# Altium schematic sheet PoE.SchDoc
size 420 x 297 mm; SPICEModelCacheUYAYKKGT: <root> / <DocumentId>UYAYKKGT</DocumentId> / <CacheFrame Number="0"> / <Model Name="1206_885012008079_10nf" Kind="CKT"> / <Text>******* / .subckt 1206_885012008079_10nF 1 2 / Rser 1 3 0.0235458917441 / Lser 2 4 4.56933086E-10 / C1 3 4 0.00000001 / Rpar 3 4 10000000000 / .ends 1206_885012008079_10nF</Text> / </Model> / <Model Name="0603_885012206114_10nf" Kind="CKT"> / <Text>******* / .subckt 0603_885012206114_10nF 1 2 / Rser 1 3 0.0614305159536 / Lser 2 4 4.58570264E-10 / C1 3 4 0.00000001 / Rpar 3 4 10000000000 / .ends 0603_885012206114_10nF</Text> / </Model> / <Model Name="0603_885012206095_100nf" Kind="CKT"> / <Text>******* / .subckt 0603_885012206095_100nF 1 2 / Rser 1 3 0.0157659152881 / Lser 2 4 3.10171966E-10 / C1 3 4 0.0000001 / Rpar 3 4 5000000000 / .ends 0603_885012206095_100nF</Text> / </Model> / <Model Name="0603_885012106006_10uf" Kind="CKT"> / <Text>******* / .subckt 0603_885012106006_10uF 1 2 / Rser 1 3 0.00407641026021 / Lser 2 4 4.16060333E-10 / C1 3 4 0.00001 / Rpar 3 4 5000000 / .ends 0603_885012106006_10uF</Text> / </Model> / <Model Name="1806_74279246_1000ohm" Kind="CKT"> / <Text>******* / .subckt 1806_74279246_1000ohm 1 2 / Rp 1 2 1045 / Cp 1 2 1.241p / Rs 1 N3 0.056 / L1 N3 2 3.003u / .ends 1806_74279246_1000ohm</Text> / </Model> / </CacheFrame> / </root>; SheetNumber: 7; SheetTotal: 11
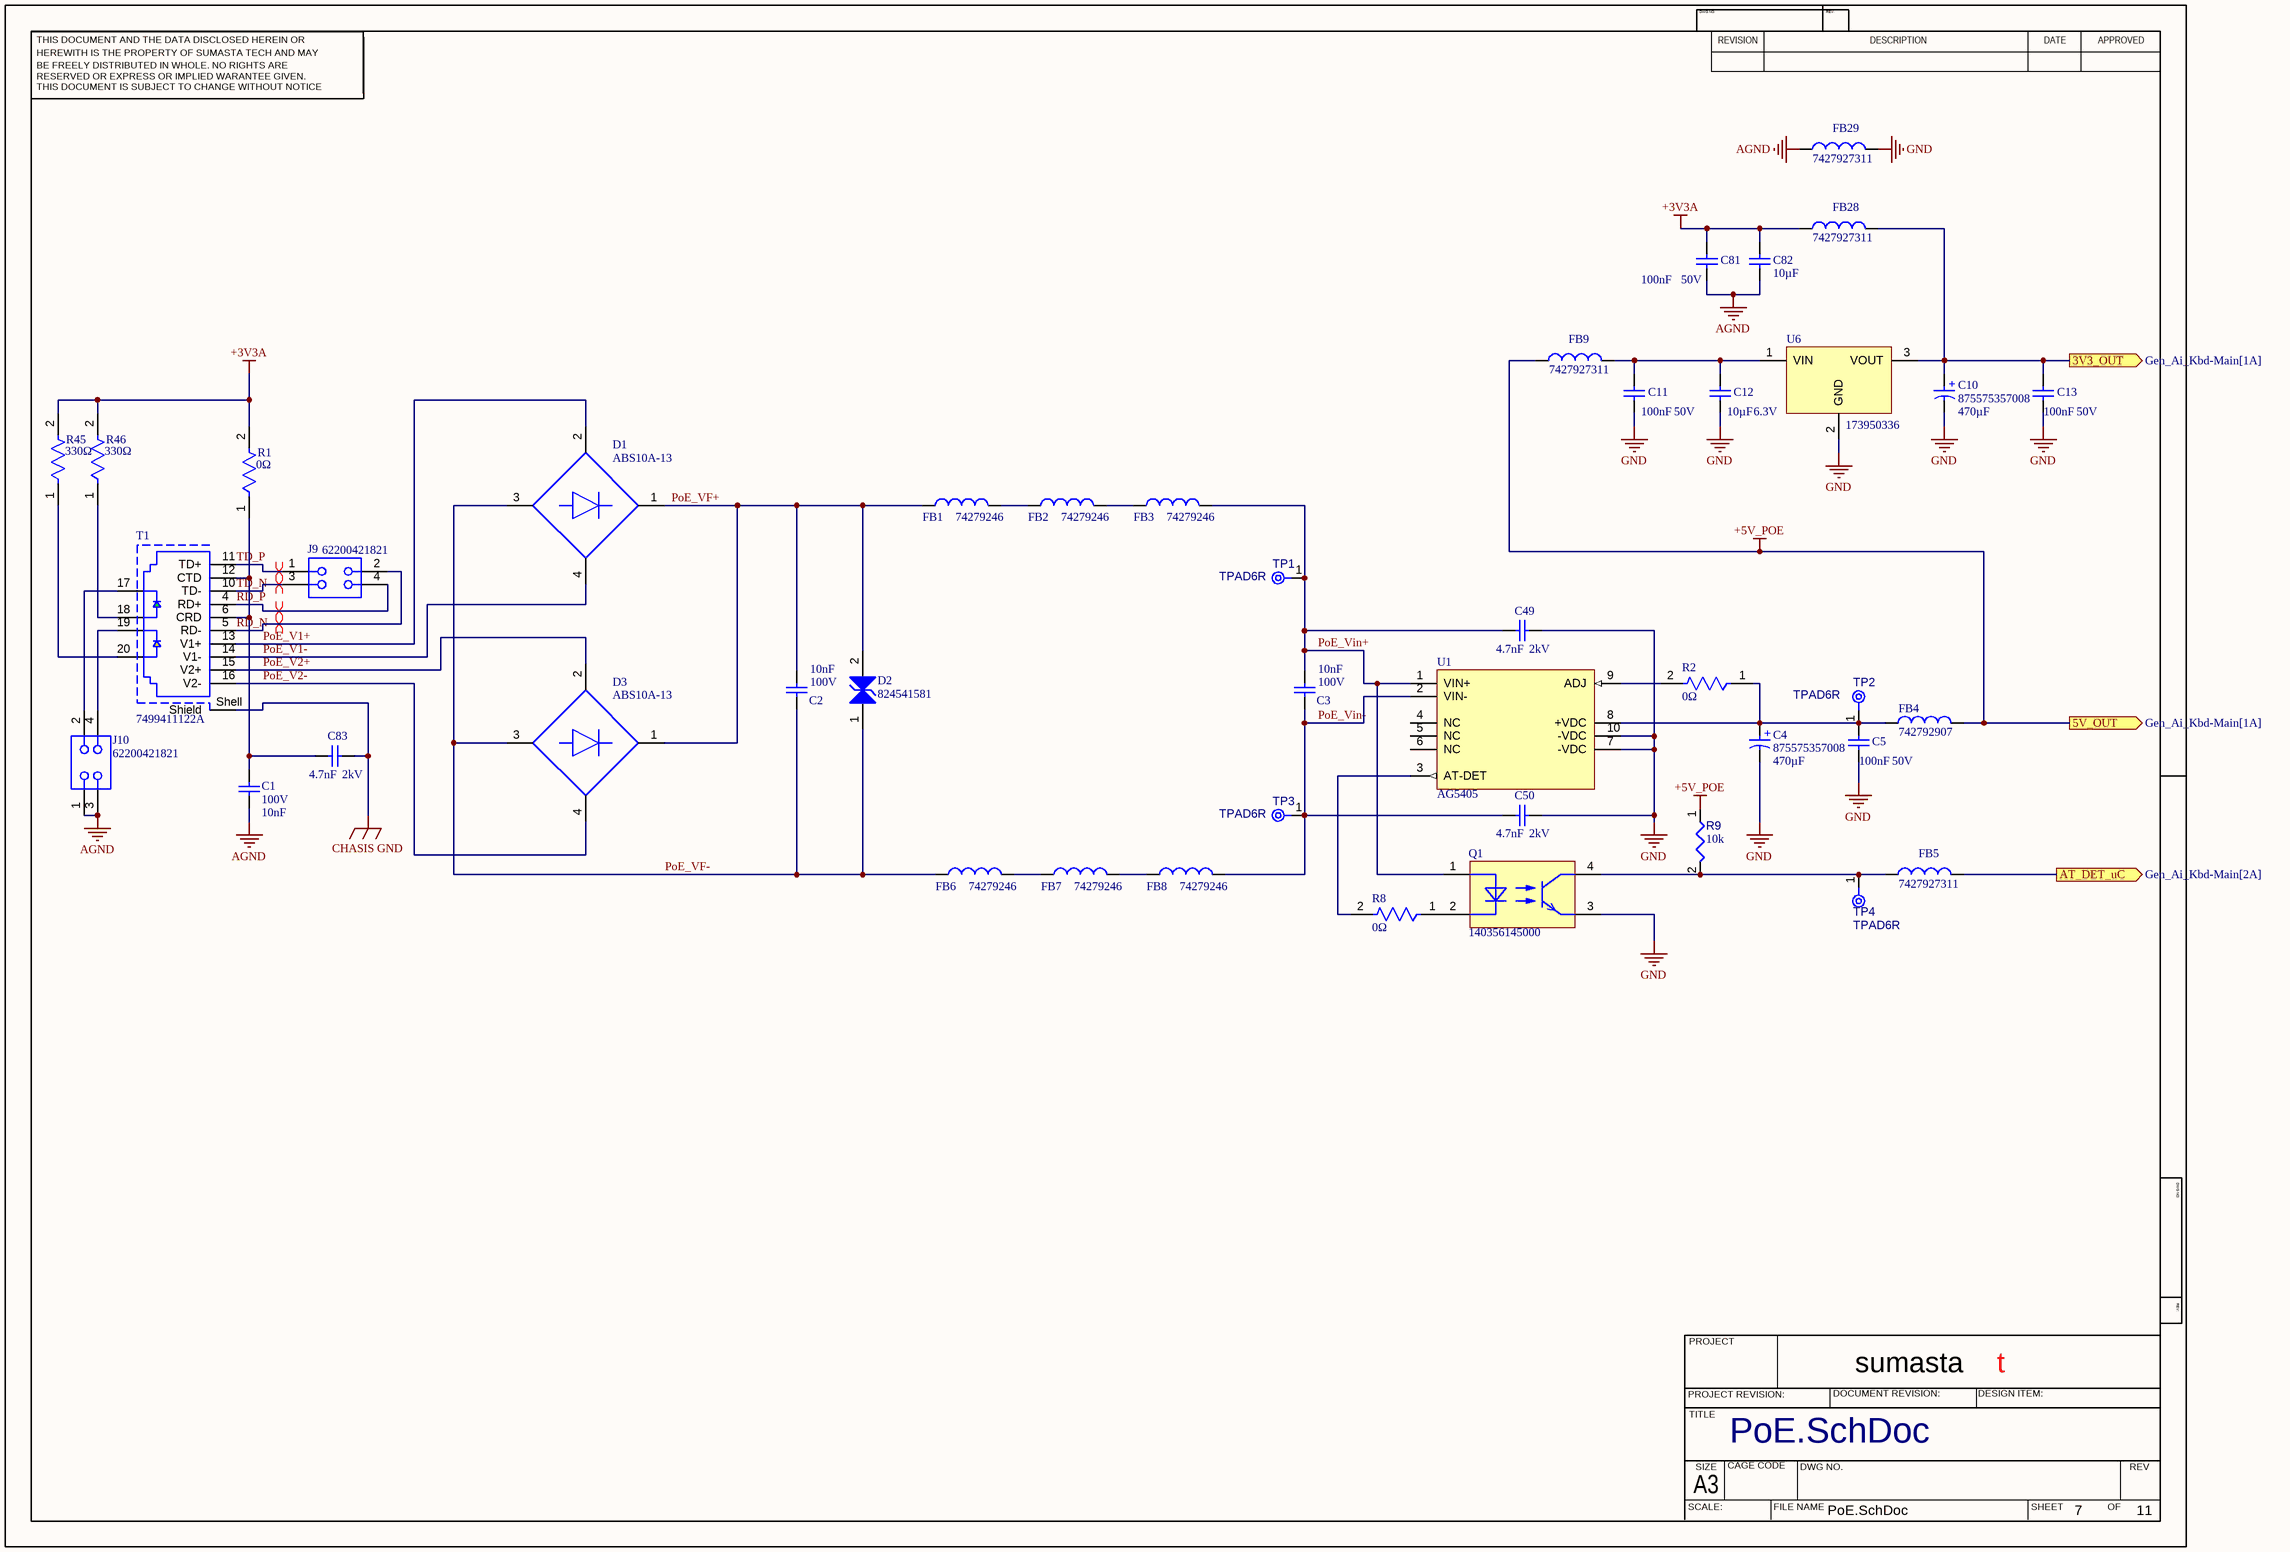
[diagram p0: PoE.SchDoc]

## Parts
C1  Rated Voltage (DC): 100V  Capacitance: 10nF  [WCAP-CSGP_0603_L1.6W0.8H0.8_Reflow]  (hidden comment: 885012206114)
C2  Rated Voltage (DC): 100V  Capacitance: 10nF  [WCAP-CSGP_1206_L3.2W1.6H1.25]  (hidden comment: 885012008079)
C3  Rated Voltage (DC): 100V  Capacitance: 10nF  [WCAP-CSGP_1206_L3.2W1.6H1.25]  (hidden comment: 885012008079)
C4  875575357008  Capacitance: 470µF  [WCAP-HSG5_D10H10.5]
C5  Capacitance: 100nF  Rated Voltage (DC): 50V  [WCAP-CSGP_0603_L1.6W0.8H0.8_Reflow]  (hidden comment: 885012206095)
C10  875575357008  Capacitance: 470µF  [WCAP-HSG5_D10H10.5]
C11  Capacitance: 100nF  Rated Voltage (DC): 50V  [WCAP-CSGP_0603_L1.6W0.8H0.8_Reflow]  (hidden comment: 885012206095)
C12  Rated Voltage (DC): 6.3V  Capacitance: 10µF  [WCAP-CSGP_0603_L1.6W0.8H0.8_Reflow]  (hidden comment: 885012106006)
C13  Capacitance: 100nF  Rated Voltage (DC): 50V  [WCAP-CSGP_0603_L1.6W0.8H0.8_Reflow]  (hidden comment: 885012206095)
C49  Voltage Rating (DC): 2kV  Capacitance: 4.7nF  [WCAP-CSMH_1812_L4.5W3.2H2]  (hidden comment: 885342211008)
C50  Voltage Rating (DC): 2kV  Capacitance: 4.7nF  [WCAP-CSMH_1812_L4.5W3.2H2]  (hidden comment: 885342211008)
C81  Capacitance: 100nF  Rated Voltage (DC): 50V  [WCAP-CSGP_0603_L1.6W0.8H0.8_Reflow]  (hidden comment: 885012206095)
C82  Capacitance: 10µF  [WCAP-CSGP_0603_L1.6W0.8H0.8_Reflow]  (hidden comment: 885012106006)
C83  Voltage Rating (DC): 2kV  Capacitance: 4.7nF  [WCAP-CSMH_1812_L4.5W3.2H2]  (hidden comment: 885342211008)
D1  ABS10A-13  [FP-SOPA-4-MFG]
D2  824541581  [WE-TVSP_DO-214AB_Bidirectional]
D3  ABS10A-13  [FP-SOPA-4-MFG]
FB1  74279246  [WE-CBF_1806_L4.5W1.6H1.6_HS/WB]
FB2  74279246  [WE-CBF_1806_L4.5W1.6H1.6_HS/WB]
FB3  74279246  [WE-CBF_1806_L4.5W1.6H1.6_HS/WB]
FB4  742792907  [WE-PF_1280]
FB5  7427927311  [WE-CBF_0402_L1W0.5H0.5_HC]
FB6  74279246  [WE-CBF_1806_L4.5W1.6H1.6_HS/WB]
FB7  74279246  [WE-CBF_1806_L4.5W1.6H1.6_HS/WB]
FB8  74279246  [WE-CBF_1806_L4.5W1.6H1.6_HS/WB]
FB9  7427927311  [WE-CBF_0402_L1W0.5H0.5_HC]
FB28  7427927311  [WE-CBF_0402_L1W0.5H0.5_HC]
FB29  7427927311  [WE-CBF_0402_L1W0.5H0.5_HC]
J9  62200421821  [62200421821]
J10  62200421821  [62200421821]
Q1  140356145000  [WL-OCPT_SOP4]
R1  value 0Ω  [FP-RC0603-MFG]  (hidden comment: RC0603FR-070RL)
R2  value 0Ω  [FP-RC0603-MFG]  (hidden comment: RC0603FR-070RL)
R8  value 0Ω  [FP-RC0603-MFG]  (hidden comment: RC0603FR-070RL)
R9  value 10k  [RESC1608X55X25ML10T15]  (hidden comment: Resistor 10k +/-1% 0603 100 mW)
R45  value 330Ω  [FP-RC0603-MFG]  (hidden comment: RC0603FR-070RL)
R46  value 330Ω  [FP-RC0603-MFG]  (hidden comment: RC0603FR-070RL)
T1  7499411122A  [7499411122A]
TP1  TPAD6R  [TP06R]  (no BOM)
TP2  TPAD6R  [TP06R]  (no BOM)
TP3  TPAD6R  [TP06R]  (no BOM)
TP4  TPAD6R  [TP06R]  (no BOM)
U1  AG5405  [AG540X]
U6  173950336  [WPME-FDSM_SIP-3_L11.6W7.55H10.16]

## Ports
3V3_OUT (out, see Gen_Ai_Kbd-Main[1A]), 5V_OUT (out, see Gen_Ai_Kbd-Main[1A]), AT_DET_uC (out, see Gen_Ai_Kbd-Main[2A])

## Nets
+3V3A: C81.2 C82.2 FB28.1 R1.2 R45.2 R46.2
+5V_POE: FB4.2 FB9.1 R9.1 ; port 5V_OUT
AGND: C1.2 C81.1 C82.1 FB29.1 J10.1 J10.3
CHASIS GND: C83.2 T1.Shell(Shield)
GND: C4.2(N) C5.1 C10.2(N) C11.1 C12.1 C13.1 C49.2 C50.2 FB29.2 Q1.3(Emitter) U1.7(-VDC) U1.10(-VDC) U6.2(GND)
3V3_OUT: C10.1(P) C13.2 FB28.2 U6.3(VOUT) ; port 3V3_OUT
AT_DET_uC: FB5.2 ; port AT_DET_uC
PoE_V1+: D1.2(1_~) T1.13(V1+)
PoE_V1-: D1.4(2_~) T1.14(V1-)
PoE_V2+: D3.2(1_~) T1.15(V2+)
PoE_V2-: D3.4(2_~) T1.16(V2-)
PoE_VF+: C2.2 D1.1(+) D2.2 D3.1(+) FB1.1
PoE_VF-: C2.1 D1.3(-) D2.1 D3.3(-) FB6.1
PoE_Vin+: C3.2 C49.1 FB3.2 Q1.1(Anode) TP1.1(TP) U1.1(VIN+)
PoE_Vin-: C3.1 C50.1 FB8.2 TP3.1(TP) U1.2(VIN-)
RD_N: J9.2 T1.5(RD-)
RD_P: J9.4 T1.4(RD+)
TD_N: J9.3 T1.10(TD-)
TD_P: J9.1 T1.11(TD+)
NetC1_1: C1.1 C83.1 R1.1 T1.6(CRD) T1.12(CTD)
NetC4_1: C4.1(P) C5.2 FB4.1 R2.1 TP2.1(TP) U1.8(+VDC)
NetC11_2: C11.2 C12.2 FB9.2 U6.1(VIN)
NetFB1_2: FB1.2 FB2.1
NetFB2_2: FB2.2 FB3.1
NetFB5_1: FB5.1 Q1.4(Collector) R9.2 TP4.1(TP)
NetFB6_2: FB6.2 FB7.1
NetFB7_2: FB7.2 FB8.1
NetJ10_2: J10.2 T1.17
NetJ10_4: J10.4 T1.19
NetQ1_2: Q1.2(Cathode) R8.1
NetR2_2: R2.2 U1.9(ADJ)
NetR8_2: R8.2 U1.3(AT-DET)
NetR45_1: R45.1 T1.20
NetR46_1: R46.1 T1.18

Not connected (* = marked no-connect by the designer): U1 4(NC) 5(NC) 6(NC)

## Layout directives
differential pair: RD_N, RD_P, TD_N, TD_P

## Notes on the sheet
- THIS DOCUMENT AND THE DATA DISCLOSED HEREIN OR
- HEREWITH IS THE PROPERTY OF SUMASTA TECH AND MAY
- DWG NO:
- REVISION
- REV:
- DESCRIPTION
- DATE
- APPROVED
- BE FREELY DISTRIBUTED IN WHOLE. NO RIGHTS ARE
- THIS DOCUMENT IS SUBJECT TO CHANGE WITHOUT NOTICE
- RESERVED OR EXPRESS OR IMPLIED WARANTEE GIVEN.
- PROJECT
- sumasta
- t
- PROJECT REVISION:
- TITLE
- DOCUMENT REVISION:
- DESIGN ITEM:
- SCALE:
- A3
- SIZE
- CAGE CODE
- FILE NAME
- DWG NO.
- SHEET
- OF
- REV
- (in symbol CMP-03913-134709151-1) +

## Library data of the parts
C1 = CMP-007-000667-1: WCAP-CSGP Multilayer Ceramic Chip Capacitor, General Purpose, size 0603, X7R, 10nF, 100VDC; Manufacturer: Wurth Elektronik; Technical Reference: X7R0603103K100DFCT10000; Insulation Resistance: 10GO; Dissipation Factor: 2.5%; Case/Size Code: 0603; Capacitance Tolerance: +/-10%; Width: 0.8mm; ComponentLink2URL: https://www.we-online.com/redexpert/spec/885012206114?ad; Packaging: Tape and Reel; Match Code: WCAP-CSGP; Source: WCAP-CSGP.SchLib; Mount: Surface Mount; Design Item ID: 885012206114; Category: Multilayer Ceramic Chip Capacitors; Manufacturer Part Number: 885012206114; Operating Temperature Max: 125°C; Operating Temperature Min: -55°C; Pin Count: 2; Height: 0.8mm; ComponentLink1URL: https://www.we-online.com/redexpert/article/885012206114?ad; ComponentLink2Description: Datasheet Link; Component Type: Standard; ComponentLink1Description: Website Link; Ceramic Type: X7R; Length: 1.6mm
C2 C3 = CMP-007-000324-1: WCAP-CSGP Multilayer Ceramic Chip Capacitor, General Purpose, size 1206, NP0, 10nF, 100VDC; Manufacturer: Wurth Elektronik; Technical Reference: NP01206103J100DFCT10000; Q Factor: 1000; Insulation Resistance: 10GO; Capacitance Tolerance: +/-5%; Case/Size Code: 1206; ComponentLink2URL: https://www.we-online.com/redexpert/spec/885012008079?ad; Packaging: Tape and Reel; Source: WCAP-CSGP.SchLib; Width: 1.6mm; Pin Count: 2; Match Code: WCAP-CSGP; Length: 3.2mm; ComponentLink1URL: https://www.we-online.com/redexpert/article/885012008079?ad; Ceramic Type: NP0; Mount: Surface Mount; ComponentLink2Description: Datasheet Link; Manufacturer Part Number: 885012008079; Operating Temperature Max: 125°C; Height: 1.25mm; ComponentLink1Description: Website Link; Design Item ID: 885012008079; Component Type: Standard; Category: Multilayer Ceramic Chip Capacitors; Operating Temperature Min: -55°C
C4 C10 = CMP-03913-134709151-1: 875575357008 Cap, 470Uf, 16V, Alu Elec, Hybrid, Smd Rohs Compliant: Yes; ESR (Equivalent Series Resistance): 20mΩ; Leakage Current: 75.2µA; Ripple Current: 2.5A; Min Operating Temperature: -55°C; RoHS: Compliant; Width: 10.3mm; Voltage Rating: 16V; Max Operating Temperature: 105°C; NexarPartId: 134709151; Length: 10.5mm; Diameter: 10mm
C5 C11 C13 C81 = CMP-007-000655-1: WCAP-CSGP Multilayer Ceramic Chip Capacitor, General Purpose, size 0603, X7R, 100nF, 50VDC; Manufacturer: Wurth Elektronik; Capacitance Tolerance: +/-10%; Insulation Resistance: 5GO; Case/Size Code: 0603; Technical Reference: X7R0603104K050DFCT10000; Dissipation Factor: 3%; Operating Temperature Max: 125°C; Category: Multilayer Ceramic Chip Capacitors; ComponentLink1Description: Website Link; Manufacturer Part Number: 885012206095; Pin Count: 2; Ceramic Type: X7R; Component Type: Standard; Mount: Surface Mount; Operating Temperature Min: -55°C; Source: WCAP-CSGP.SchLib; ComponentLink2URL: https://www.we-online.com/redexpert/spec/885012206095?ad; Packaging: Tape and Reel; Match Code: WCAP-CSGP; Width: 0.8mm; ComponentLink1URL: https://www.we-online.com/redexpert/article/885012206095?ad; Height: 0.8mm; Design Item ID: 885012206095; Length: 1.6mm; ComponentLink2Description: Datasheet Link
C12 = CMP-007-000403-1: WCAP-CSGP Multilayer Ceramic Chip Capacitor, General Purpose, size 0603, X5R, 10µF, 6.3VDC; Manufacturer: Wurth Elektronik; Insulation Resistance: 0.01GO; Technical Reference: X5R0603106M6R3DFCT10000; Dissipation Factor: 10%; Case/Size Code: 0603; Capacitance Tolerance: +/-20%; Mount: Surface Mount; Packaging: Tape and Reel; ComponentLink1URL: https://www.we-online.com/redexpert/article/885012106006?ad; Height: 0.8mm; ComponentLink2URL: https://www.we-online.com/redexpert/spec/885012106006?ad; Category: Multilayer Ceramic Chip Capacitors; Operating Temperature Max: 85°C; Operating Temperature Min: -55°C; Source: WCAP-CSGP.SchLib; Match Code: WCAP-CSGP; Design Item ID: 885012106006; Ceramic Type: X5R; Manufacturer Part Number: 885012106006; Component Type: Standard; Pin Count: 2; Width: 0.8mm; ComponentLink2Description: Datasheet Link; ComponentLink1Description: Website Link; Length: 1.6mm
C49 C50 C83 = CMP-03913-89205791-1: 885342211008 4700PF 2000V X7R 1812 10% - Multilayer Ceramic Capacitors; Insulation Resistance: 10GΩ; RoHS: Compliant; Length: 4.5mm; Min Operating Temperature: -55°C; Dielectric: X7R; Width: 3.2mm; NexarPartId: 89205791; Max Operating Temperature: 125°C; Height: 2mm; Voltage Rating: 2kV
C82 = CMP-007-000403-1: WCAP-CSGP Multilayer Ceramic Chip Capacitor, General Purpose, size 0603, X5R, 10µF, 6.3VDC; Manufacturer: Wurth Elektronik; Rated Voltage (DC): 6.3V; Insulation Resistance: 0.01GO; Technical Reference: X5R0603106M6R3DFCT10000; Dissipation Factor: 10%; Case/Size Code: 0603; Capacitance Tolerance: +/-20%; Mount: Surface Mount; Packaging: Tape and Reel; ComponentLink1URL: https://www.we-online.com/redexpert/article/885012106006?ad; Height: 0.8mm; ComponentLink2URL: https://www.we-online.com/redexpert/spec/885012106006?ad; Category: Multilayer Ceramic Chip Capacitors; Operating Temperature Max: 85°C; Operating Temperature Min: -55°C; Source: WCAP-CSGP.SchLib; Match Code: WCAP-CSGP; Design Item ID: 885012106006; Ceramic Type: X5R; Manufacturer Part Number: 885012106006; Component Type: Standard; Pin Count: 2; Width: 0.8mm; ComponentLink2Description: Datasheet Link; ComponentLink1Description: Website Link; Length: 1.6mm
D1 D3 = CMP-12791-000054-1: BRIDGE RECT 1PHASE 1KV 1A 4SOPA; Min Operating Temperature: -55°C; Max Operating Temperature: 150°C; Case/Package: SMD/SMT; Average Rectified Current: 1A; Mount: Surface Mount; Packaging: Cut Tape
D2 = CMP-03913-71101705-1: 824541581 TVS diode [Würth Elektronik] 824541581 TVS diode; Max Breakdown Voltage: 67.8V; Leakage Current: 1µA; Number of Bidirectional Channels: 1; Polarity: Bidirectional; Peak Pulse Power: 1.5kW; Peak Pulse Current: 16.1A; Power Line Protection: No; Reverse Standoff Voltage: 58V; Clamping Voltage: 93.6V; Max Operating Temperature: 150°C; REACH SVHC: Unknown; Height: 2.5mm; Min Operating Temperature: -65°C; Min Breakdown Voltage: 67.8V; Number of Pins: 2; Length: 6.86mm; Composition: Zener; NexarPartId: 71101705; Mount: Surface Mount; RoHS: Compliant; Packaging: Cut Tape; Breakdown Voltage: 67.8V; Width: 5.91mm
FB1-FB3 FB6-FB8 = CMP-021-000088-1: WE-CBF SMT EMI Suppression Ferrite Bead, size 1806, 1000Ohm, 1.5A; Manufacturer: Wurth Elektronik; Impedance Max Test Condition: 85MHz; Case/Size Code: 1806; DC Resistance Max: 0.09Ohm; Impedance Max: 1045Ohm; Type: Wide Band; ComponentLink2URL: https://www.we-online.com/redexpert/spec/74279246?ad; Impedance @100MHz: 1000Ohm; ComponentLink2Description: Datasheet Link; Design Item ID: 74279246; Category: Ferrites for PCB Assembly; ComponentLink1Description: Website Link; Length: 4.5mm; Height: 1.6mm; Manufacturer Part Number: 74279246; Packaging: Tape and Reel; Operating Temperature Min: -55°C; Component Type: Standard; Source: WE-CBF.SchLib; Pin Count: 2; Operating Temperature Max: 125°C; Width: 1.6mm; Mount: Surface Mount; Rated Current: 1.5A; ComponentLink1URL: https://www.we-online.com/redexpert/article/74279246?ad; Match Code: WE-CBF
FB4 = CMP-0220-00071-2: NexarPartId: 21911586; Current Rating: 6A; Tolerance: 25%; Number of Lines: 1; Test Frequency: 100MHz; Impedance: 7.5kΩ; DC Resistance (DCR): 20mΩ; Packaging: Cut Tape; REACH SVHC: Unknown; Max Current Rating: 6A; Case/Package: SMD/SMT; Mount: Surface Mount; Max DC Current: 6A; Length: 12mm; Width: 12mm; Termination: SMD/SMT; Min Operating Temperature: -40°C; Max Operating Temperature: 125°C; RoHS: Compliant; Height: 8mm
FB5 FB9 FB28 FB29 = CMP-0220-00132-2: NexarPartId: 19122429; Max Current Rating: 1.2A; Impedance: 120Ω; Number of Lines: 1; Tolerance: 25%; DC Resistance (DCR): 90mΩ; Test Frequency: 100MHz; Height: 500µm; Material: Ferrite; Width: 500µm; Mount: Surface Mount; Case/Package: SMD/SMT; Max Operating Temperature: 125°C; Current Rating: 1.2A; Case Code (Imperial): 0402; RoHS: Compliant; REACH SVHC: Unknown; Depth: 500µm; Max DC Current: 1.2A; Case Code (Metric): 1005; Length: 1mm; Termination: SMD/SMT; Packaging: Digi-Reel®; Lead Free: Lead Free; Min Operating Temperature: -55°C
J9 J10 = CMP-1502-01179-2: NexarPartId: 65162209; Contact Resistance: 20mΩ; Gender: Female; Current Rating: 1A; Operating Supply Voltage: 250V; Lead Pitch: 1.27mm; Contact Material: Copper; RoHS: Non-Compliant; Number of Pins: 4; Orientation: Vertical
Q1 = CMP-03913-114060666-1: 140356145000 Optocoupler, Transistor, 80V, Sop-4 Rohs Compliant: Yes; Forward Voltage: 1.24V; Max Reverse Voltage (DC): 6V; Forward Current: 60mA; Isolation Voltage: 3.75kV; Width: 3.6mm; RoHS: Compliant; NexarPartId: 114060666; Length: 4.4mm; Min Operating Temperature: -55°C; Max Operating Temperature: 110°C; Height: 2mm
R1 R2 R8 = CMP-2000-06925-2: RES SMD 0 OHM JUMPER 1/10W 0603; Manufacturer: Yageo; Tolerance: 1%; Power Rating: 0.1W; Voltage Rating: 75V; Composition: Thick Film; Temperature Range Low: -55°C; Ipc Land Pattern Name: RESC16080X45; Lead Free: Yes; Digikey Description: RES SMD 0 OHM JUMPER 1/10W 0603; Height: 0.55mm; Automotive: No; Device Class L3: Chip SMD Resistors; Device Class L1: Passive Components; Device Class L2: Resistors; Footprint Url: http://www.yageo.com/exep/pages/download/literatures/PYu-R_Mount_10.pdf; Category: Res; Mouser Description: RC Series 0603 0.1 W 0 O Jumper Surface Mount Thick Film Chip Resistor; Resistance: 0Ω; ComponentLink2URL: http://www.yageo.com/documents/recent/PYu-RC_Group_51_RoHS_L_10.pdf; Series: RC_L; ComponentLink2Description: Datasheet; RoHS: TRUE; Temperature: -55°C to +155°C; Temperature Range High: +155°C; Package: RC0603; Octopart: https://octopart.com/rc0603fr-070rl-yageo-1180803; Manufacturer Part Number: RC0603FR-070RL
R9 = CMP-009-00017-5: Chip Resistor, 10 KOhm, +/- 1%, 01 W, -55 to 155 degC, 0603 (1608 Metric); Voltage Rating: 50V; Power: 100mW; RoHS Compliant: True; Min Operating Temperature: -55°C; Pins: 2; Case/Package: 0603; Mounting Technology: SM; Max Operating Temperature: 155°C; Tolerance: 1%
R45 R46 = CMP-2000-06925-2: RES SMD 0 OHM JUMPER 1/10W 0603; Manufacturer: Yageo; Tolerance: 1%; Power Rating: 0.1W; Voltage Rating: 75V; Resistance: 0Ω; Composition: Thick Film; Temperature Range Low: -55°C; Ipc Land Pattern Name: RESC16080X45; Lead Free: Yes; Digikey Description: RES SMD 0 OHM JUMPER 1/10W 0603; Height: 0.55mm; Automotive: No; Device Class L3: Chip SMD Resistors; Device Class L1: Passive Components; Device Class L2: Resistors; Footprint Url: http://www.yageo.com/exep/pages/download/literatures/PYu-R_Mount_10.pdf; Category: Res; Mouser Description: RC Series 0603 0.1 W 0 O Jumper Surface Mount Thick Film Chip Resistor; ComponentLink2URL: http://www.yageo.com/documents/recent/PYu-RC_Group_51_RoHS_L_10.pdf; Series: RC_L; ComponentLink2Description: Datasheet; RoHS: TRUE; Temperature: -55°C to +155°C; Temperature Range High: +155°C; Package: RC0603; Octopart: https://octopart.com/rc0603fr-070rl-yageo-1180803; Manufacturer Part Number: RC0603FR-070RL
T1 = CMP-03913-82944263-1: 7499411122A Rj45 Conn, R/A Jack, 8P8C, 1Port, Th Rohs Compliant: Yes; Color: Silver; Connector Type: Socket; Insertion Loss (dB): -1dB; Inductance: 350µH; Contact Material: Gold; Width: 17mm; RoHS: Compliant; Case/Package: Metal; Min Operating Temperature: 0°C; Height: 13.87mm; Max Operating Temperature: 70°C; NexarPartId: 82944263; Length: 33.02mm
TP1-TP4 = CMP-00028-00002-2: 0.6mm round; Pins: 1
U1 = CMP-019-00052-1: PoE Module 802.3at
U6 = CMP-03913-104891430-1: 173950336 WPME-FDSM Fixed Step Down Regulator Module; Output Current: 500mA; Max Switching Frequency: 520kHz; Min Input Voltage: 4.75V; Max Input Voltage: 36V; Max Output Voltage: 3.3V; Min Operating Temperature: -40°C; Height: 10.16mm; Ambient Temperature Range Low: -40°C; NexarPartId: 104891430; Max Operating Temperature: 125°C; Length: 11.6mm; Width: 7.55mm; Ambient Temperature Range High: 85°C; RoHS: Compliant